# Altium schematic sheet PSU.SchDoc
size A; SheetNumber: 1; SheetTotal: 1
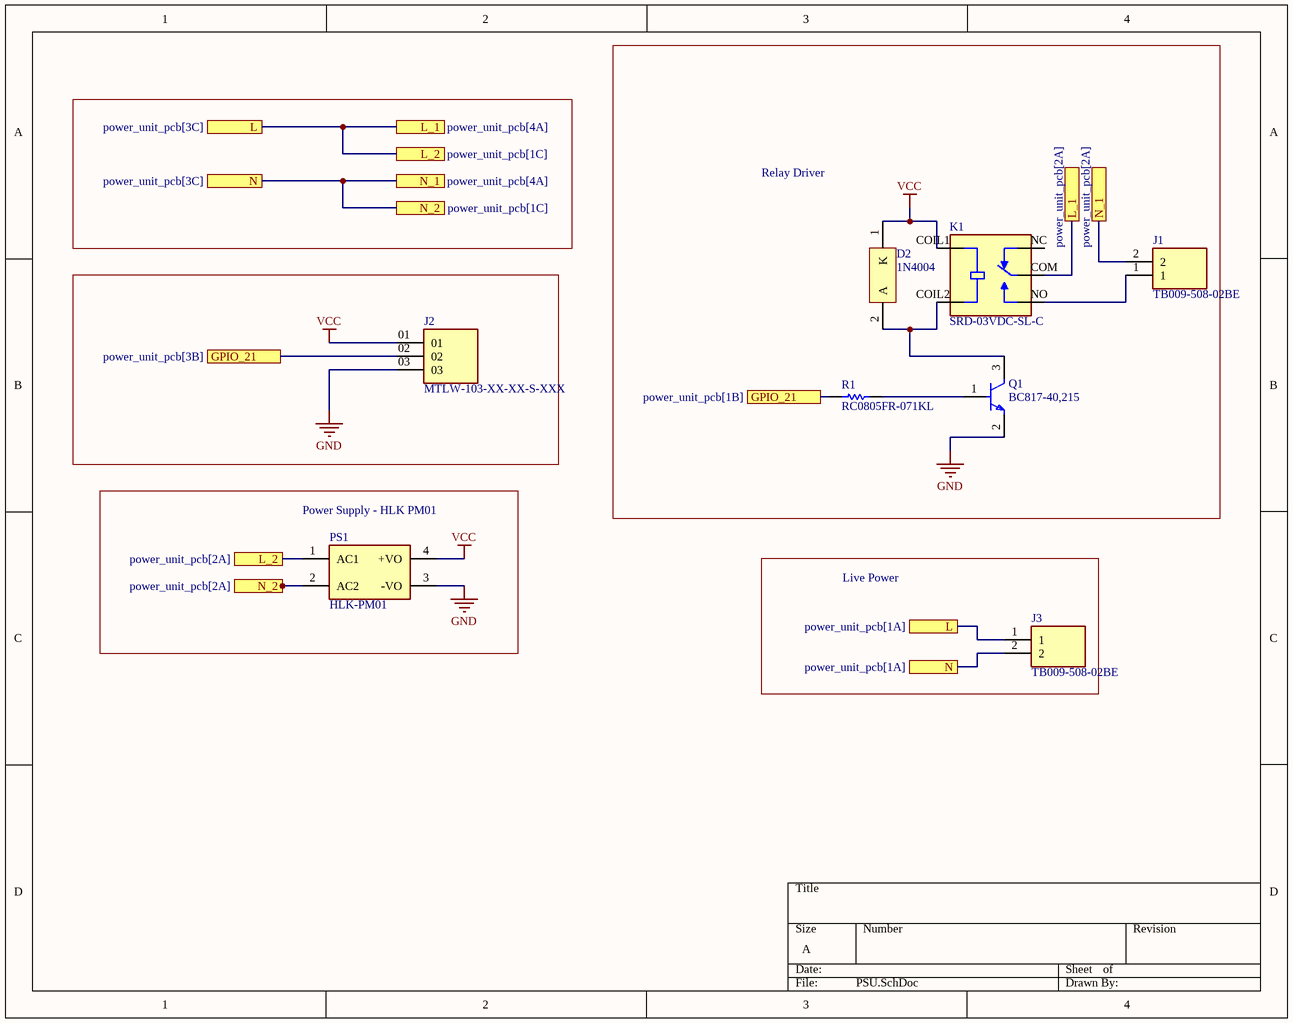
[diagram p0: PSU.SchDoc]

## Parts
D2  1N4004  [ONSC-AXIAL_LEAD-2-59-10_P]
J1  TB009-508-02BE  [CUI_TB009-508-02BE]
J2  MTLW-103-XX-XX-S-XXX  [SAMTEC_HTSW-103-XX-X-S]
J3  TB009-508-02BE  [CUI_TB009-508-02BE]
K1  SRD-03VDC-SL-C  [RELAY_SRD-03VDC-SL-C]
PS1  HLK-PM01  [CONV_HLK-PM01]
Q1  BC817-40,215  [FP-SOT23-IPC_A]
R1  RC0805FR-071KL  [RESC2013X60X35ML10T20]

## Blocks framed on the sheet
Relay Driver: D2 J1 K1 Q1 R1
Power Supply - HLK PM01: PS1
Live Power: J3

## Ports
GPIO_21 (see power_unit_pcb[1B]), GPIO_21 (see power_unit_pcb[3B]), L (see power_unit_pcb[1A]), L (see power_unit_pcb[3C]), L_1 (see power_unit_pcb[2A]), L_1 (see power_unit_pcb[4A]), L_2 (see power_unit_pcb[1C]), L_2 (see power_unit_pcb[2A]), N (see power_unit_pcb[1A]), N (see power_unit_pcb[3C]), N_1 (see power_unit_pcb[2A]), N_1 (see power_unit_pcb[4A]), N_2 (see power_unit_pcb[1C]), N_2 (see power_unit_pcb[2A])

## Nets
GND: J2.03 PS1.3(-VO) Q1.2(E)
VCC: D2.1(K) J2.01 K1.COIL1 PS1.4(+VO)
GPIO_21: J2.02 R1.1 ; port GPIO_21
L: J3.1 K1.COM PS1.1(AC1) ; port L_1, port L, port L_2
N: J1.2 J3.2 PS1.2(AC2) ; port N_1, port N, port N_2
NetD2_2: D2.2(A) K1.COIL2 Q1.3(C)
NetJ1_1: J1.1 K1.NO
NetQ1_1: Q1.1(B) R1.2

Not connected (* = marked no-connect by the designer): K1 NC

## Library data of the parts
D2 = CMP-0902-00115-1: Standard Recovery Rectifier, 2-Pin Axial_Lead, Pb-Free, Bulk Bag; Manufacturer: On Semiconductor; IFSM Max (A): 30; IO(rec) Max (A): 1; VRRM Max (V): 400; Type: Standard Recovery; Packing: Bulk Bag; PackageVersion: Rev. U, 02/2005; ComponentLink1URL: http://www.onsemi.com/; ComponentLink3URL: http://www.onsemi.cn/pub_link/Collateral/59-10.PDF; DatasheetVersion: Rev. 13; PartNumber: 1N4004; ComponentLink1Description: Manufacturer URL; Mounting Technology: Through Hole; PackageReference: AXIAL_LEAD-2-59-10; ComponentLink3Description: Package Specification; ComponentLink2URL: http://www.onsemi.com/pub_link/Collateral/1N4001-D.PDF; ComponentLink2Description: Datasheet; PackageDescription: 2-Pin, Axial Lead, Diameter 2.35 mm; RoHS: TRUE
J1 J3 = CMP-002-00071-1: 2~24 Poles, Screw Type, Horizontal, 5.08 Pitch, 26~12 (AWG), Terminal Block Connector; MF: Same Sky; Design Item ID: TB009-508-02BE; SnapEDA_Link: https://www.snapeda.com/parts/TB009-508-02BE/Same+Sky/view-part/?ref=snap; Component Type: Standard; MP: TB009-508-02BE; Value: *; Source: TB009-508-02BE.SchLib; Case/Package: None; Pins: 2; Check_prices: https://www.snapeda.com/parts/TB009-508-02BE/Same+Sky/view-part/?ref=eda
J2 = MTLW-103-XX-XX-S-XXX: Connector Header Through Hole 40 position 0.100" (2.54mm); Package: None; Price: None; Value: *; MP: MTLW-103-XX-XX-S-XXX; Availability: Unavailable
K1 = CMP-003-000000-1: Relays General Purpose Non Latching 3VDC SPDT 10A (250VAC) Max 5PIN; MF: Songle Relay; SnapEDA_Link: https://www.snapeda.com/parts/SRD-03VDC-SL-C/Songle+Relay/view-part/?ref=snap; Check_prices: https://www.snapeda.com/parts/SRD-03VDC-SL-C/Songle+Relay/view-part/?ref=eda; Component Type: Standard; Value: *; Package: NON STANDARD-5 Songle Relay; Source: SRD-03VDC-SL-C.SchLib; Pin Count: 5; Design Item ID: SRD-03VDC-SL-C; MP: SRD-03VDC-SL-C
PS1 = HLK-PM01: The HLK-PM01 is a small size low cost AC to DC converter which can take in 110V/220V AC at 50/60 Hz and give 5V 3W output. The module is can be used in designs which run on 5V and needs to be powered form the AC mains.; MF: Hi-link; Source: HLK-PM01.SchLib; Check_prices: https://www.snapeda.com/parts/hlk-pm01/Hi-link/view-part/?ref=eda; Component Type: Standard; Pin Count: 4; Value: *; MP: hlk-pm01; Design Item ID: HLK-PM01; Package: None; SnapEDA_Link: https://www.snapeda.com/parts/hlk-pm01/Hi-link/view-part/?ref=snap; LCSC Part Number: C209903
Q1 = BC817-40,215: TRANS NPN 45V 0.5A SOT23; Manufacturer: Nexperia; Collector Emitter Saturation Voltage: 700mV; Power Dissipation: 250mW; Collector Base Voltage: 50V; Unity Gain Freq: 100MHz; Hfe Max: 600; Rthja Max: 500K/W; Emitter Base Voltage: 5V; Max Collector Current: 500mA; Hfe Testvce: 1V; Automotive Grade: Grade 0; Hfe Min: 250; Max Junction Temp: +150°C; Number Of Npn: 1; Hfe Testic: 100mA; Octopart: https://octopart.com/bc817-40%2C215-nexperia-78739081; Lead Free: Yes; Ipc Land Pattern Name: SOT95P230X100-3; Manufacturer Part Number: BC817-40,215; RoHS: TRUE; Collector Emitter Breakdown Voltage: 45V; Digikey Description: TRANS NPN 45V 0.5A SOT23; ComponentLink2URL: https://assets.nexperia.com/documents/data-sheet/BC817_SER.pdf; Temperature Range High: +150°C; Mouser Description: BC817 Series 45 V 500 mA 250 mW SMT NPN General-Purpose Transistor - SOT-23-; Device Class L3: BJTs; Temperature: to +150°C; Height: 1.1mm; Automotive: Yes; Ambient Temperature Range Low: -65°C; Package: SOT23; Collector Emitter Voltage: 45V; Category: Trans; ComponentLink2Description: Datasheet; Device Class L2: Transistors; Ambient Temperature Range High: +150°C; Number Of Elements: 1; Device Class L1: Discrete Semiconductors; Footprint Url: https://assets.nexperia.com/documents/outline-drawing/SOT23.pdf; LCSC Part Number: C52801
R1 = CMP-2100-03671-1: Chip Resistor, 1 KOhm, +/- 1%, 125 mW, -55 to 155 degC, 0805 (2012 Metric), RoHS, Tape and Reel; Manufacturer: Yageo; Temperature Coefficient: 100ppm/degreesC; Voltage Rating (DC): 150V; Max Power Dissipation: 125mW; Resistance: 1KOhm; Number of Pins: 2; Number of Terminations: 2; Datasheet URL: http://www.yageo.com/NewPortal/yageodocoutput?fileName=/pdf/R-Chip/PYu-RC_Group_51_RoHS_L_5.pdf; Length: 0.079inch; Package Description: 2-Pin Surface Mounted Device, Body 2 x 1.25 mm; Depth: 1.25mm; Height: 0.024inch; Military Standard: Not; Case/Package: 0805; Package Reference: 0805; RoHSCompliant: true; Lead Free: LeadFree; Packaging: TapeandReel; Package Quantity: 1; Datasheet Version: Rev. 5, 10/2016; Tolerance: 1%; Min Operating Temperature: -55degC; Voltage Rating: 150V; Composition: ThickFilm; Case Code (Imperial): 0805; Power Rating: 125mW; Width: 0.049inch; Case Code (Metric): 2012; Manufacturer URL: http://www.yageo.com/; Max Operating Temperature: 155degC; REACH SVHC: Unknown; Termination: SMD/SMT